# Altium project BpfBoard.PrjPcb
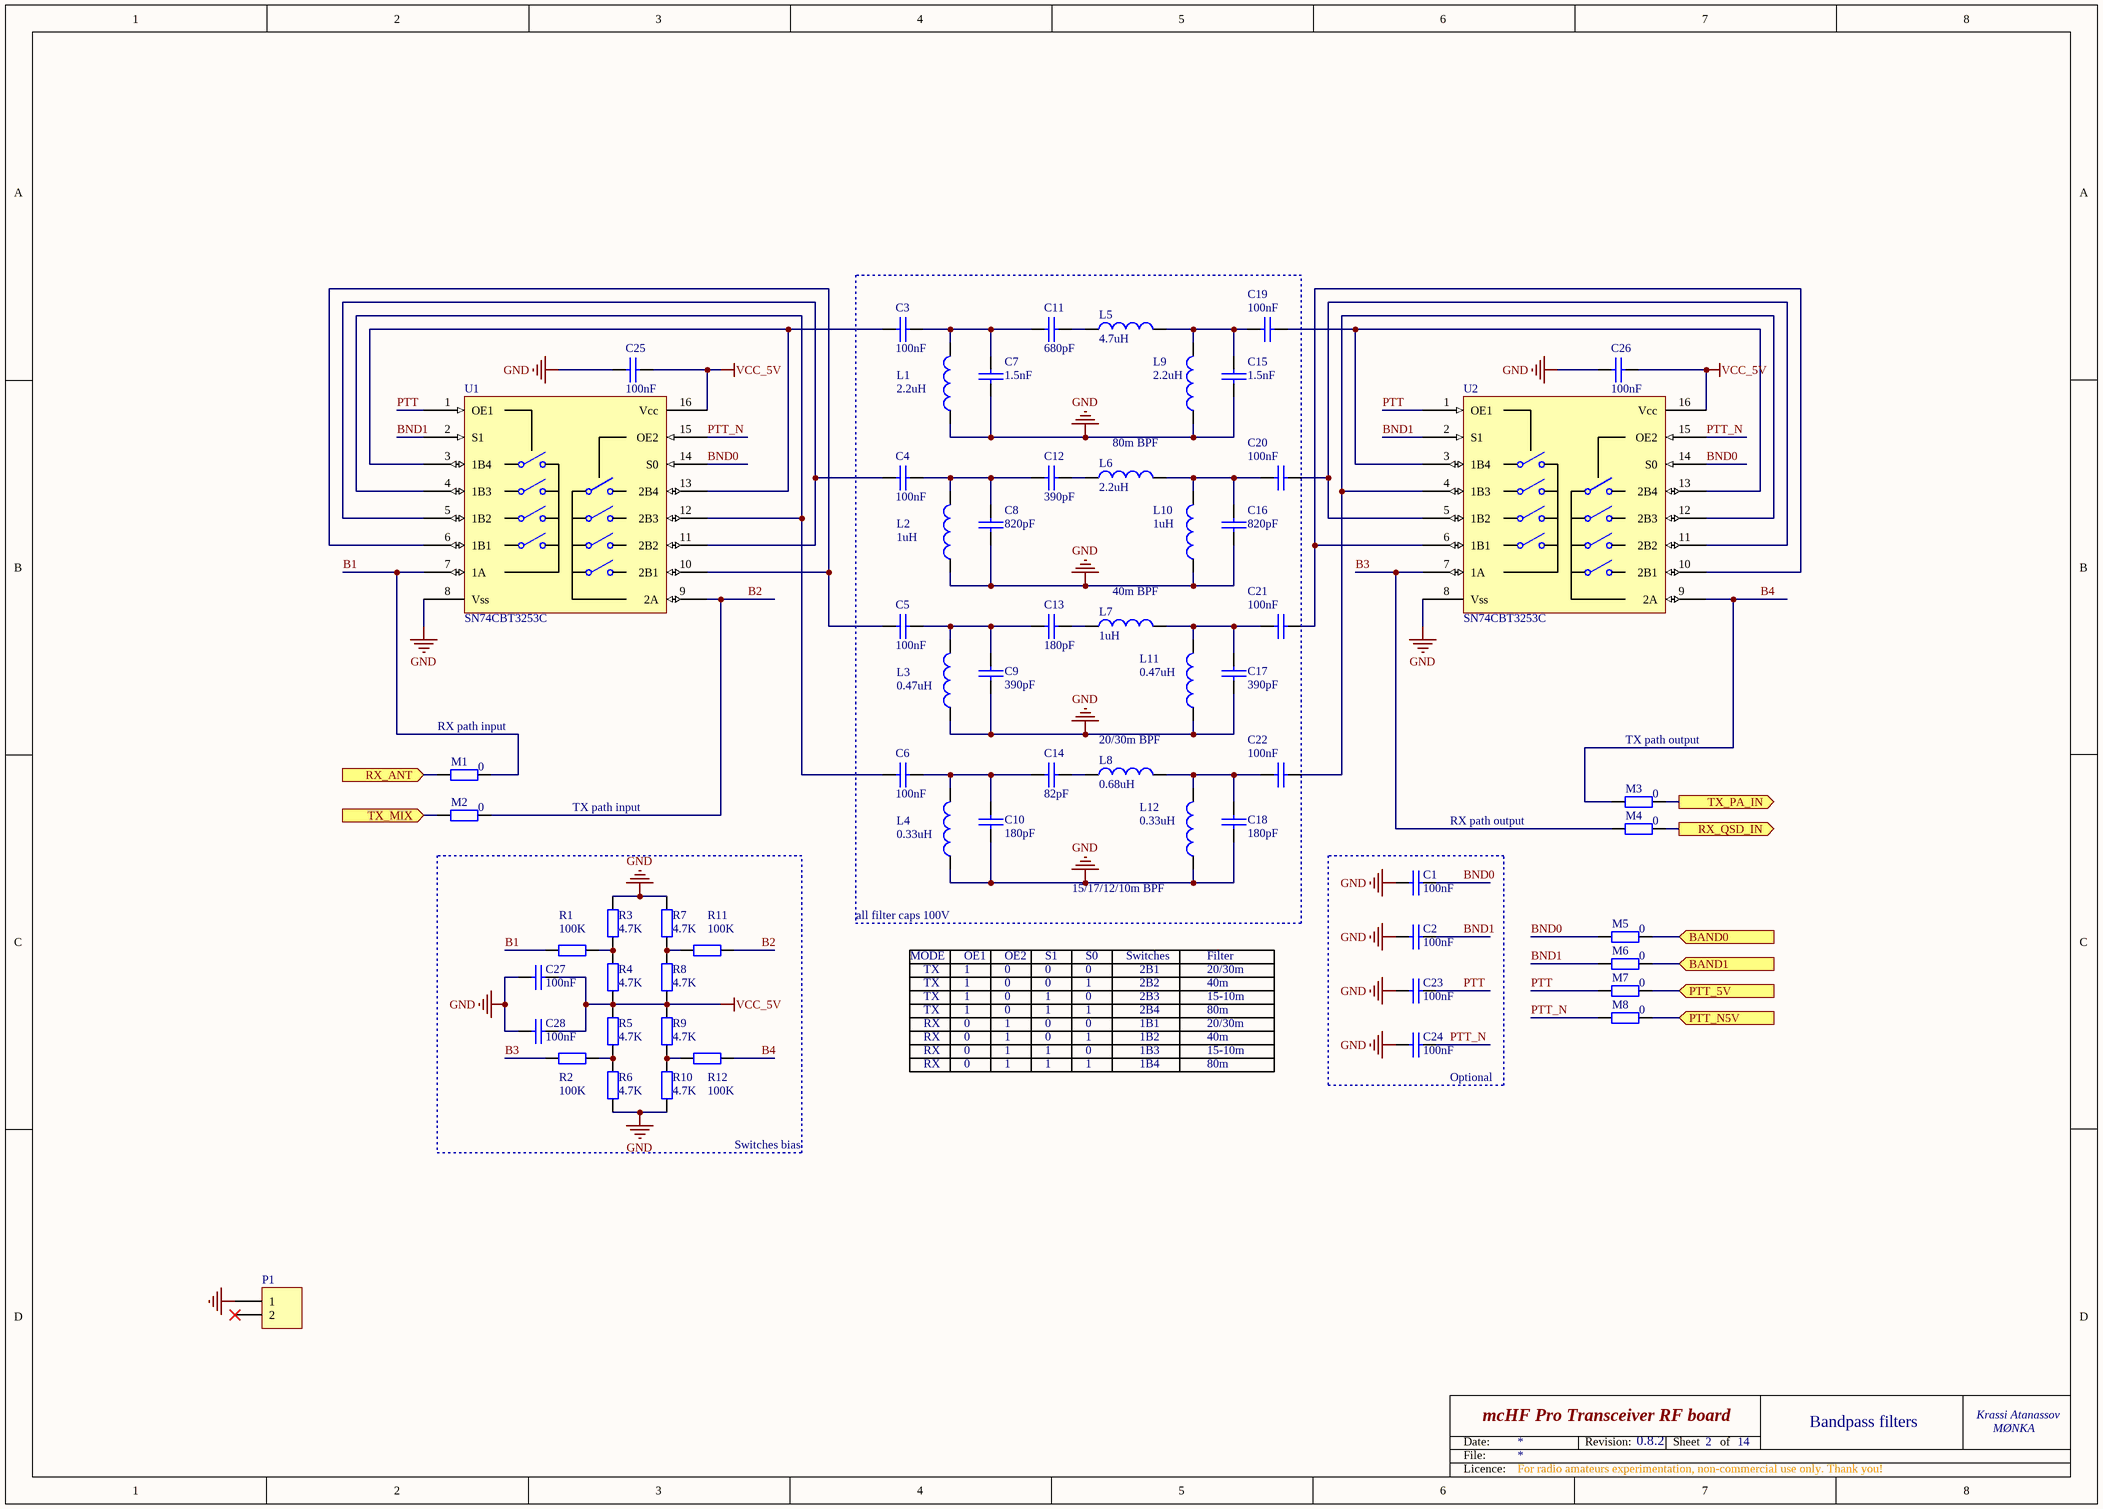
[diagram p0: bpf.SchDoc]
1 sheet, 63 parts. Net scope: flat (ports and power ports of the same name join across sheets).

## Sheet bpf.SchDoc: mcHF Pro Transceiver RF board
size A3; Author: Krassi Atanassov; CompanyName: MØNKA; Engineer: For radio amateurs experimentation, non-commercial use only. Thank you!; Revision: 0.8.2; SheetTotal: 14

### Parts
C1  100nF  [0805]
C2  100nF  [0805]
C3  100nF  [0805]
C4  100nF  [0805]
C5  100nF  [0805]
C6  100nF  [0805]
C7  1.5nF  [0805]
C8  820pF  [0805]
C9  390pF  [0805]
C10  180pF  [0805]
C11  680pF  [0805]
C12  390pF  [0805]
C13  180pF  [0805]
C14  82pF  [0805]
C15  1.5nF  [0805]
C16  820pF  [0805]
C17  390pF  [0805]
C18  180pF  [0805]
C19  100nF  [0805]
C20  100nF  [0805]
C21  100nF  [0805]
C22  100nF  [0805]
C23  100nF  [0805]
C24  100nF  [0805]
C25  100nF  [0805]
C26  100nF  [0805]
C27  100nF  [0805]
C28  100nF  [0805]
L1  2.2uH  [0805]
L2  1uH  [0805]
L3  0.47uH  [0805]
L4  0.33uH  [0805]
L5  4.7uH  [0805]
L6  2.2uH  [0805]
L7  1uH  [0805]
L8  0.68uH  [0805]
L9  2.2uH  [0805]
L10  1uH  [0805]
L11  0.47uH  [0805]
L12  0.33uH  [0805]
M1  0  [0805]
M2  0  [0805]
M3  0  [0805]
M4  0  [0805]
M5  0  [0805]
M6  0  [0805]
M7  0  [0805]
M8  0  [0805]
P1  Header 2  [SIP2]  (value not drawn)
R1  100K  [0805]
R2  100K  [0805]
R3  4.7K  [0805]
R4  4.7K  [0805]
R5  4.7K  [0805]
R6  4.7K  [0805]
R7  4.7K  [0805]
R8  4.7K  [0805]
R9  4.7K  [0805]
R10  4.7K  [0805]
R11  100K  [0805]
R12  100K  [0805]
U1  SN74CBT3253C  [SO-16]
U2  SN74CBT3253C  [SO-16]

### Blocks framed on the sheet
Switches bias: C27 C28 R1-R12
Optional: C1 C2 C23 C24

### Ports
BAND0 (in), BAND1 (in), PTT_5V (in), PTT_N5V (in), RX_ANT (in), RX_QSD_IN (out), TX_MIX (in), TX_PA_IN (out)

### Nets
GND: C1.2 C2.2 C7.2 C8.2 C9.1 C10.1 C15.2 C16.2 C17.1 C18.1 C23.2 C24.2 C25.2 C26.2 C27.2 C28.2 L1.1 L2.1 L3.1 L4.1 L9.1 L10.1 L11.1 L12.1 P1.1 R3.1 R6.2 R7.1 R10.2 U1.8(Vss) U2.8(Vss)
VCC_5V: C25.1 C26.1 C27.1 C28.1 R4.2 R5.1 R8.2 R9.1 U1.16(Vcc) U2.16(Vcc)
B1: M1.1 R1.1 U1.7(1A)
B2: M2.1 R11.2 U1.9(2A)
B3: M4.2 R2.1 U2.7(1A)
B4: M3.2 R12.2 U2.9(2A)
BND0: C1.1 M5.2 U1.14(S0) U2.14(S0)
BND1: C2.1 M6.2 U1.2(S1) U2.2(S1)
PTT: C23.1 M7.2 U1.1(OE1) U2.1(OE1)
PTT_N: C24.1 M8.2 U1.15(OE2) U2.15(OE2)
NetC3_1: C3.1 C7.1 C11.1 L1.2
NetC3_2: C3.2 U1.3(1B4) U1.13(2B4)
NetC4_1: C4.1 C8.1 C12.1 L2.2
NetC4_2: C4.2 U1.5(1B2) U1.11(2B2)
NetC5_1: C5.1 C9.2 C13.1 L3.2
NetC5_2: C5.2 U1.6(1B1) U1.10(2B1)
NetC6_1: C6.1 C10.2 C14.1 L4.2
NetC6_2: C6.2 U1.4(1B3) U1.12(2B3)
NetC11_2: C11.2 L5.1
NetC12_2: C12.2 L6.1
NetC13_2: C13.2 L7.1
NetC14_2: C14.2 L8.1
NetC15_1: C15.1 C19.2 L5.2 L9.2
NetC16_1: C16.1 C20.2 L6.2 L10.2
NetC17_2: C17.2 C21.2 L7.2 L11.2
NetC18_2: C18.2 C22.2 L8.2 L12.2
NetC19_1: C19.1 U2.3(1B4) U2.13(2B4)
NetC20_1: C20.1 U2.5(1B2) U2.11(2B2)
NetC21_1: C21.1 U2.6(1B1) U2.10(2B1)
NetC22_1: C22.1 U2.4(1B3) U2.12(2B3)
NetM1_2: M1.2 ; port RX_ANT
NetM2_2: M2.2 ; port TX_MIX
NetM3_1: M3.1 ; port TX_PA_IN
NetM4_1: M4.1 ; port RX_QSD_IN
NetM5_1: M5.1 ; port BAND0
NetM6_1: M6.1 ; port BAND1
NetM7_1: M7.1 ; port PTT_5V
NetM8_1: M8.1 ; port PTT_N5V
NetR1_2: R1.2 R3.2 R4.1
NetR2_2: R2.2 R5.2 R6.1
NetR7_2: R7.2 R8.1 R11.1
NetR9_2: R9.2 R10.1 R12.1

Not connected (* = marked no-connect by the designer): P1 2*

### Notes on the sheet
- (near L6) 80m BPF
- (near L7) 40m BPF
- (near M1) RX path input
- 20/30m BPF
- TX path output
- TX path input
- RX path output
- all filter caps 100V
- (near L12) 15/17/12/10m BPF
- MODE
- TX
- OE1
- 1
- 0
- OE2
- S1
- S0
- Switches
- 2B1
- 2B2
- Filter
- 20/30m
- 40m
- RX
- 2B4
- 2B3
- 1B2
- 1B3
- 1B1
- 15-10m
- 80m
- 1B4
- 2
- Bandpass filters
- Date:
- File:
- Revision:
- Sheet
- of
- Licence:

### Library data of the parts
C1-C6 C19-C28 = CAP: Capacitor; QT Order: QCC-00154; Price: 0.068
C7 C15 = CAP: Capacitor; QT Order: QCC-00082; Notes: COG/NPO; Price: 0.124
C8 C16 = CAP: Capacitor; QT Order: QCC-00147; Notes: COG/NPO; Price: 0.074
C9 C12 C17 = CAP: Capacitor; QT Order: QCC-00125; Notes: COG/NPO; Price: 0.078
C10 C13 C18 = CAP: Capacitor; QT Order: QCC-00084; Notes: COG/NPO; Price: 0.058
C11 = CAP: Capacitor; Notes: COG/NPO; Price: 0.074
C14 = CAP: Capacitor; QT Order: QCC-00069; Notes: COG/NPO; Price: 0.074
L1-L12 = BPF_IND: INDUCTOR SMD; Price: 0.166
M1-M8 = RES: Resistor; QT Order: QCR-00268; Price: 0.009
P1 = Header 2: Header, 2-Pin
R1 R2 R11 R12 = RES: Resistor; QT Order: QCR-00373; Price: 0.021
R3-R10 = RES: Resistor; QT Order: QCR-00341; Price: 0.024
U1 U2 = SN74CBT3253C: Dual 4:1 Demux/Analog Switch; Price: 0.69